# EasyEDA schematic schematic-easyeda.json
TITLE: Sheet_1; REV: 1.0; Date: 2026-05-03; Sheet: 1/1; Drawn By: kimtaehwan; Company: Your Company
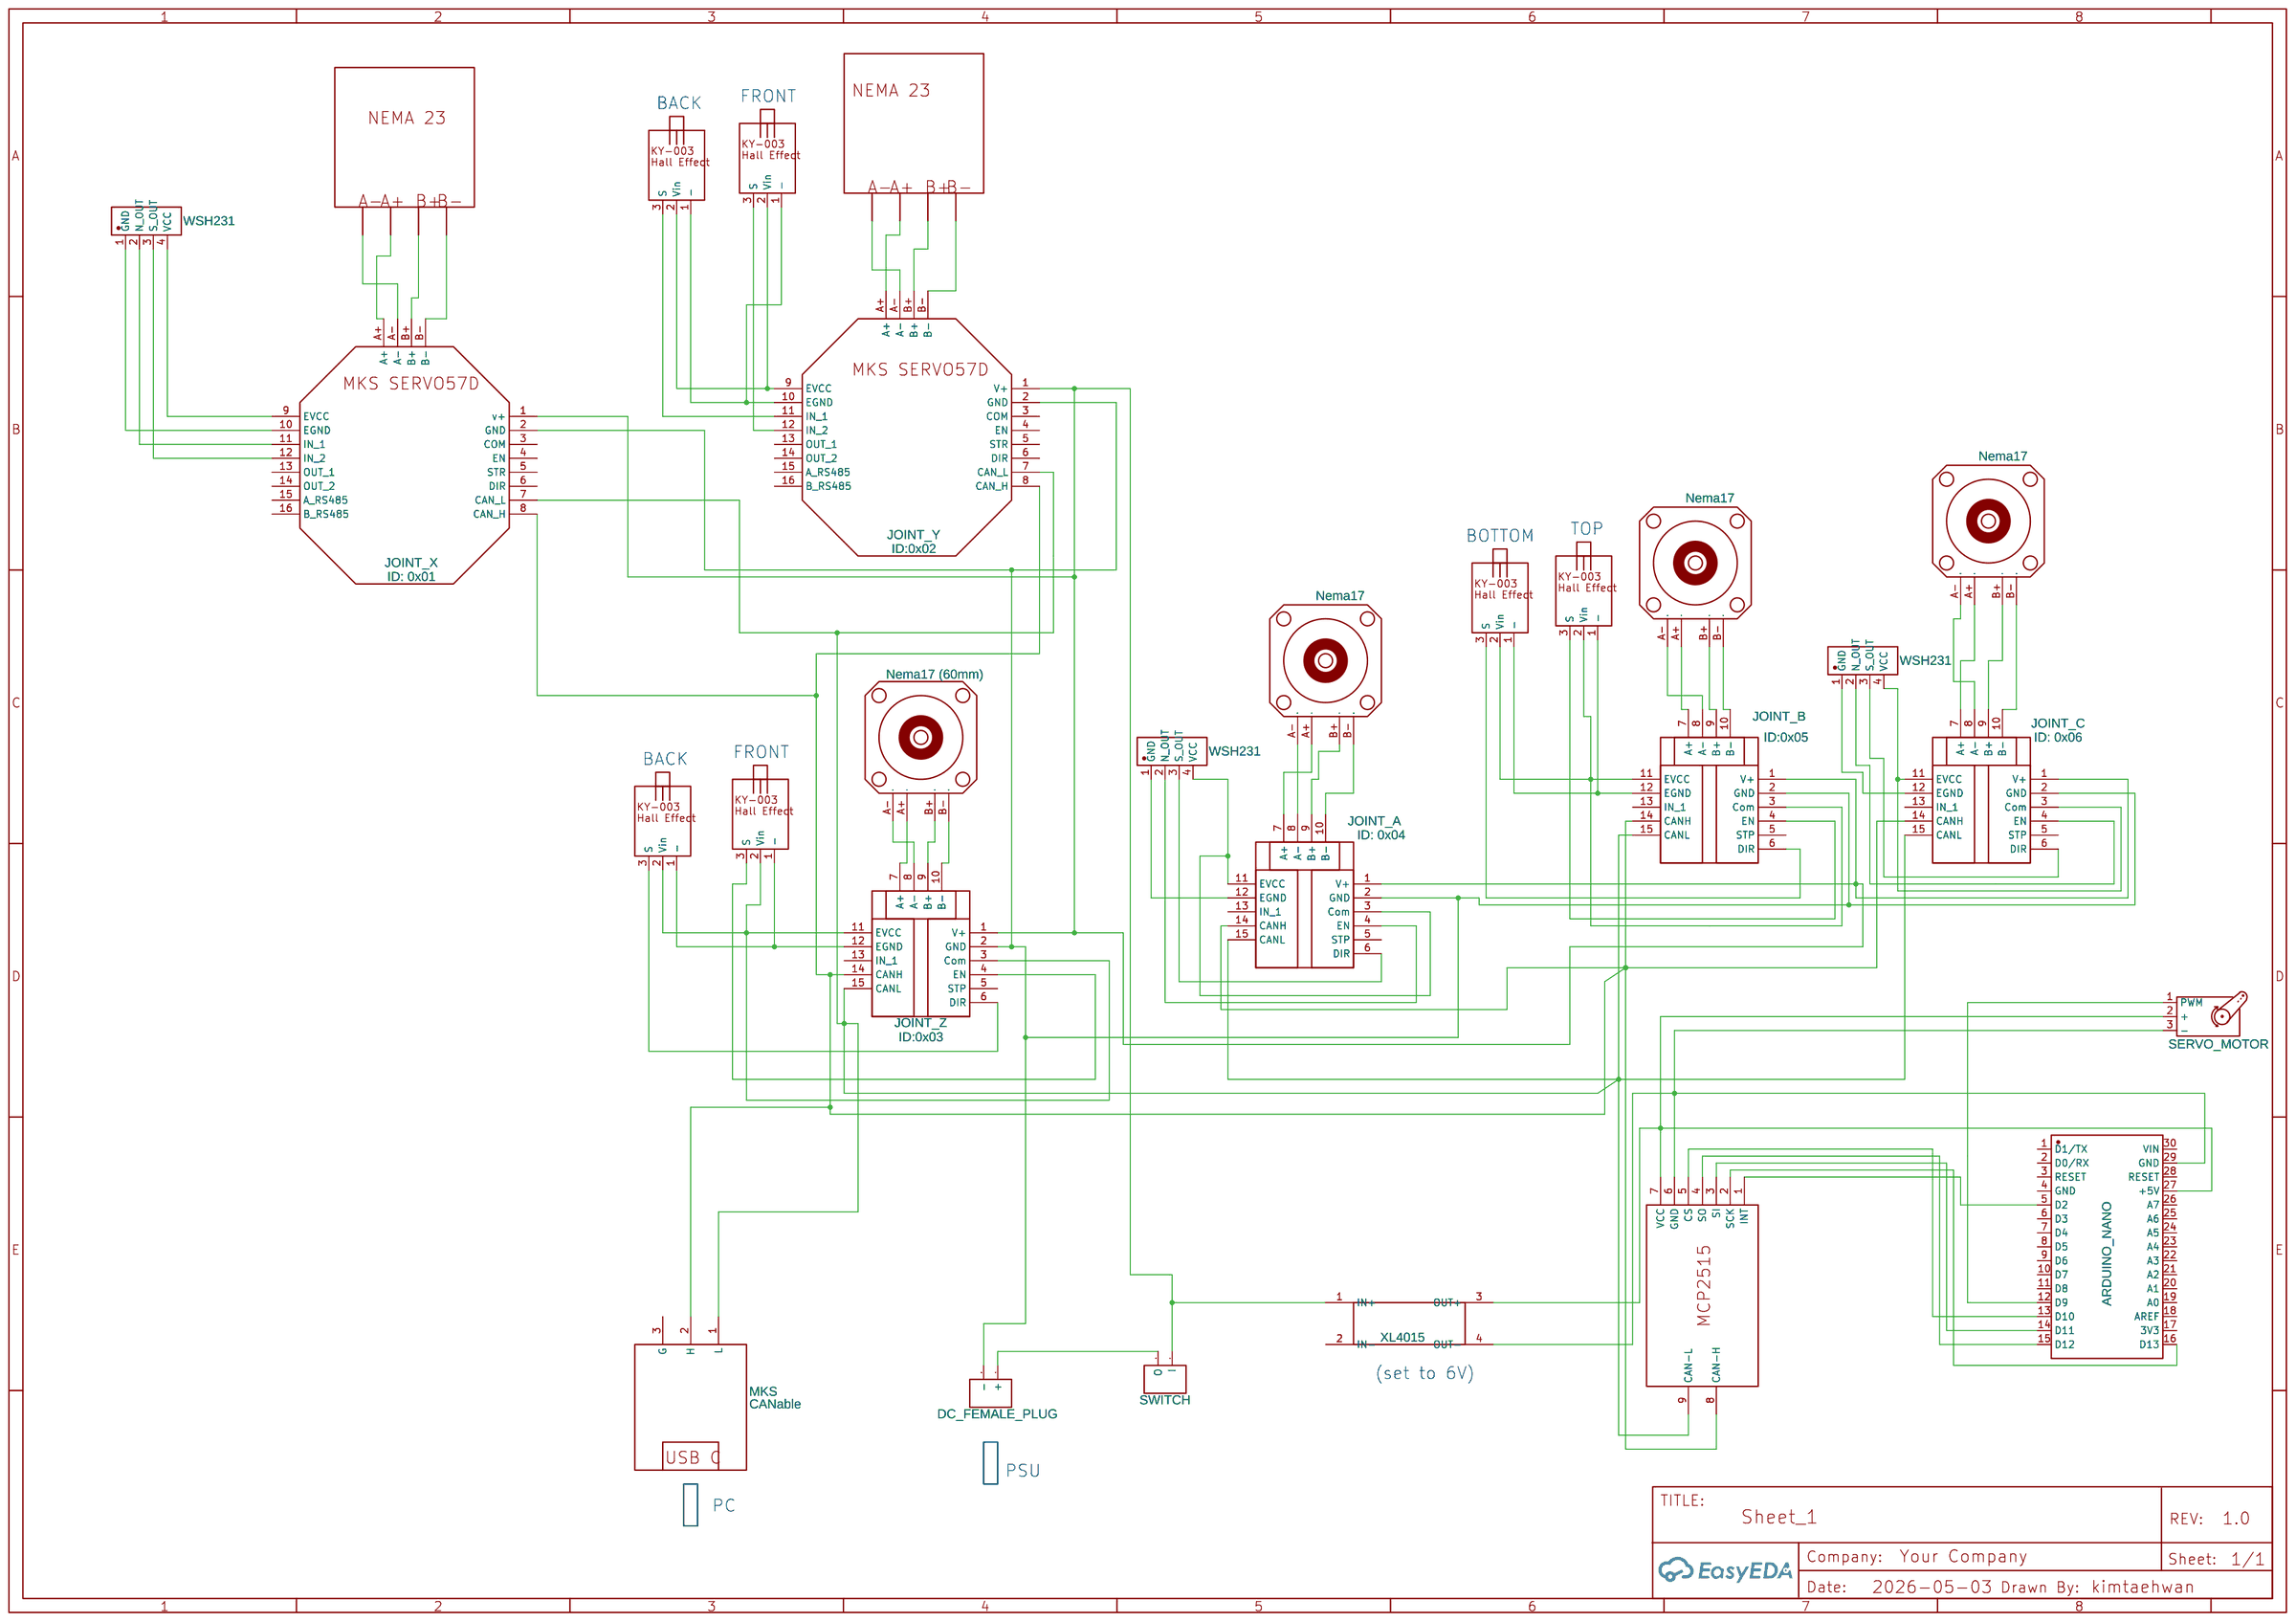
[diagram p0: schematic sheet]

## Parts
CN1  WSH231  [CONN-TH_4P-L14.5-W4.7-P2.20]
CN2  WSH231  [CONN-TH_4P-L14.5-W4.7-P2.20]
CN3  WSH231  [CONN-TH_4P-L14.5-W4.7-P2.20]
H1  SWITCH  [HDR-F-2.54_1X2]
H2  DC_FEMALE_PLUG  [HDR-F-2.54_1X2]
JOINT_A  ID: 0x04
JOINT_B  ID:0x05
JOINT_C  ID: 0x06
JOINT_X  ID: 0x01
JOINT_Y  ID:0x02
JOINT_Z  ID:0x03
M1  SERVO_MOTOR
MKS  CANable
MY  Nema17  [NEMA17]
MY1  Nema17  [NEMA17]
MY2  Nema17  [NEMA17]
MY3  Nema17 (60mm)  [NEMA17]
U1  ARDUINO_NANO  [COMM-TH_ARDUINO_NANO]
U2  MCP2515CANSPI  [MCP2515CANSPI]
U3  XL4015  [XL4015DC-DC]
U4  KY-003 Hall Effect Sensor  [KY-003 HALL EFFECT SENSOR]
U5  KY-003 Hall Effect Sensor  [KY-003 HALL EFFECT SENSOR]
U6  KY-003 Hall Effect Sensor  [KY-003 HALL EFFECT SENSOR]
U7  KY-003 Hall Effect Sensor  [KY-003 HALL EFFECT SENSOR]
U8  Nema23
U10  KY-003 Hall Effect Sensor  [KY-003 HALL EFFECT SENSOR]
U11  KY-003 Hall Effect Sensor  [KY-003 HALL EFFECT SENSOR]
U12  Nema23

## Library data of the parts
CN1-CN3 = STRAIGHT 4 PINS MAGNETIC CONNECTOR MALE: Supplier: LCSC; Supplier Part: C9900150562; Manufacturer: null; Manufacturer Part: Straight 4 pins magnetic connector Male; Contributor: lcsc
H1 H2 = HDR-F-2.54_1x2: Supplier Part: C49661; Supplier: LCSC; Contributor: LCEDA_Lib
JOINT_A JOINT_B JOINT_C JOINT_Z = MKS_SERVO42D: Contributor: wayneosdias
JOINT_X JOINT_Y = MKS SERVO57D RS485 MB PCBA NEMA23: Manufacturer: Makerbase; Manufacturer Part: SERVO57D RS485 MB PCBA NEMA23; Supplier Part: Makerbase; link: https://aliexpress.ru/item/1005005389455615.html?sku_id=12000032915421054&spm=a2g2w.productlist.search_results.0.237761daW0Z3rS; Contributor: kulbickijv1988
M1 = Motor_Servo: Contributor: KiCAD; license: https://www.gnu.org/licenses/lgpl-2.1.html
MKS = CANable: Contributor: fred_aapp
MY MY1-MY3 = Nema17: Contributor: oliver.vera5390
U1 = ARDUINO_NANO: Contributor: lcsc; Supplier: LCSC; Supplier Part: C9900017879; Manufacturer: null; JLCPCB Part Class: Extended Part
U2 = MCP2515CANSPI: Contributor: rclandrover
U3 = XL4015DC-DC_symbol: Contributor: to_ttpro
U4-U7 U10 U11 = KY-003 Hall Effect Sensor: Contributor: marshallvisions
U8 U12 = Nema23: Manufacturer Part: 57STH56-4004A; Supplier: PoLabs; link: https://ca.robotshop.com/products/nema-23-stepper-motor-sy57sth56-4004a; Contributor: adamleitch

## Nets
Net-(CN1-1): CN1.1(GND) JOINT_C.12(EGND)
Net-(CN1-2): CN1.2(N_OUT) JOINT_C.4(EN)
Net-(CN1-3): CN1.3(S_OUT) JOINT_C.6(DIR)
Net-(CN1-4): CN1.4(VCC) JOINT_C.3(Com) JOINT_C.11(EVCC)
Net-(CN2-1): CN2.1(GND) JOINT_A.12(EGND)
Net-(CN2-2): CN2.2(N_OUT) JOINT_A.4(EN)
Net-(CN2-3): CN2.3(S_OUT) JOINT_A.6(DIR)
Net-(CN2-4): CN2.4(VCC) JOINT_A.3(Com) JOINT_A.11(EVCC)
Net-(CN3-1): CN3.1(GND) JOINT_X.10(EGND)
Net-(CN3-2): CN3.2(N_OUT) JOINT_X.11(IN_1)
Net-(CN3-3): CN3.3(S_OUT) JOINT_X.12(IN_2)
Net-(CN3-4): CN3.4(VCC) JOINT_X.9(EVCC)
Net-(H1-1): H1.1(I) JOINT_A.1(V+) JOINT_B.1(V+) JOINT_C.1(V+) JOINT_X.1(v+) JOINT_Y.1(V+) JOINT_Z.1(V+) U3.1(IN+)
Net-(H1-2): H1.2(O) H2.1(+)
Net-(H2-2): H2.2(-) JOINT_A.2(GND) JOINT_B.2(GND) JOINT_C.2(GND) JOINT_X.2(GND) JOINT_Y.2(GND) JOINT_Z.2(GND)
Net-(JOINT_A-7): JOINT_A.7(A+) MY2.A+(A)
Net-(JOINT_A-8): JOINT_A.8(A-) MY2.A-(B)
Net-(JOINT_A-9): JOINT_A.9(B+) MY2.B+(A)
Net-(JOINT_A-10): JOINT_A.10(B-) MY2.B-(B)
Net-(JOINT_A-14): JOINT_A.14(CANH) JOINT_B.14(CANH) JOINT_C.14(CANH) JOINT_X.8(CAN_H) JOINT_Y.8(CAN_H) JOINT_Z.14(CANH) MKS.2(H) U2.8(CAN-H)
Net-(JOINT_A-15): JOINT_A.15(CANL) JOINT_B.15(CANL) JOINT_C.15(CANL) JOINT_X.7(CAN_L) JOINT_Y.7(CAN_L) JOINT_Z.15(CANL) MKS.1(L) U2.9(CAN-L)
Net-(JOINT_B-3): JOINT_B.3(Com) JOINT_B.11(EVCC) U4.2(Vin) U5.2(Vin)
Net-(JOINT_B-4): JOINT_B.4(EN) U4.3(S)
Net-(JOINT_B-6): JOINT_B.6(DIR) U5.3(S)
Net-(JOINT_B-7): JOINT_B.7(A+) MY1.A+(A)
Net-(JOINT_B-8): JOINT_B.8(A-) MY1.A-(B)
Net-(JOINT_B-9): JOINT_B.9(B+) MY1.B+(A)
Net-(JOINT_B-10): JOINT_B.10(B-) MY1.B-(B)
Net-(JOINT_B-12): JOINT_B.12(EGND) U4.1(-) U5.1(-)
Net-(JOINT_C-7): JOINT_C.7(A+) MY.A+(A)
Net-(JOINT_C-8): JOINT_C.8(A-) MY.A-(B)
Net-(JOINT_C-9): JOINT_C.9(B+) MY.B+(A)
Net-(JOINT_C-10): JOINT_C.10(B-) MY.B-(B)
Net-(JOINT_Y-9): JOINT_Y.9(EVCC) U10.2(Vin) U11.2(Vin)
Net-(JOINT_Y-10): JOINT_Y.10(EGND) U10.1(-) U11.1(-)
Net-(JOINT_Y-11): JOINT_Y.11(IN_1) U11.3(S)
Net-(JOINT_Y-12): JOINT_Y.12(IN_2) U10.3(S)
Net-(JOINT_Z-3): JOINT_Z.3(Com) JOINT_Z.11(EVCC) U6.2(Vin) U7.2(Vin)
Net-(JOINT_Z-4): JOINT_Z.4(EN) U6.3(S)
Net-(JOINT_Z-6): JOINT_Z.6(DIR) U7.3(S)
Net-(JOINT_Z-7): JOINT_Z.7(A+) MY3.A+(A)
Net-(JOINT_Z-8): JOINT_Z.8(A-) MY3.A-(B)
Net-(JOINT_Z-9): JOINT_Z.9(B+) MY3.B+(A)
Net-(JOINT_Z-10): JOINT_Z.10(B-) MY3.B-(B)
Net-(JOINT_Z-12): JOINT_Z.12(EGND) U6.1(-) U7.1(-)
Net-(M1-1): M1.1(PWM) U1.12(D9)
Net-(M1-2): M1.2(+) U1.27(+5V) U2.7(VCC) U3.3(OUT+)
Net-(M1-3): M1.3(-) U1.29(GND) U2.6(GND) U3.4(OUT-)
Net-(U1-5): U1.5(D2) U2.1(INT)
Net-(U1-13): U1.13(D10) U2.5(CS)
Net-(U1-14): U1.14(D11) U2.3(SI)
Net-(U1-15): U1.15(D12) U2.4(SO)
Net-(U1-16): U1.16(D13) U2.2(SCK)

Not connected (* = marked no-connect by the designer): JOINT_A 5(STP) 13(IN_1); JOINT_B 5(STP) 13(IN_1); JOINT_C 5(STP) 13(IN_1); JOINT_X 3(COM) 4(EN) 5(STR) 6(DIR) 13(OUT_1) 14(OUT_2) 15(A RS485) 16(B RS485) A+ A- B+ B-; JOINT_Y 3(COM) 4(EN) 5(STR) 6(DIR) 13(OUT_1) 14(OUT_2) 15(A RS485) 16(B RS485) A+ A- B+ B-; JOINT_Z 5(STP) 13(IN_1); MKS 3(G); U1 1(D1/TX) 2(D0/RX) 3(RESET) 4(GND) 6(D3) 7(D4) 8(D5) 9(D6) 10(D7) 11(D8) 17(3V3) 18(AREF) 19(A0) 20(A1) 21(A2) 22(A3) 23(A4) 24(A5) 25(A6) 26(A7) 28(RESET) 30(VIN); U3 2(IN-)

## Notes on the sheet
- FRONT
- BACK
- TOP
- BOTTOM
- BACK
- FRONT
- (set to 6V)
- PSU
- PC
